# EAGLE schematic ATmega328 (EAGLE 6.6.0)
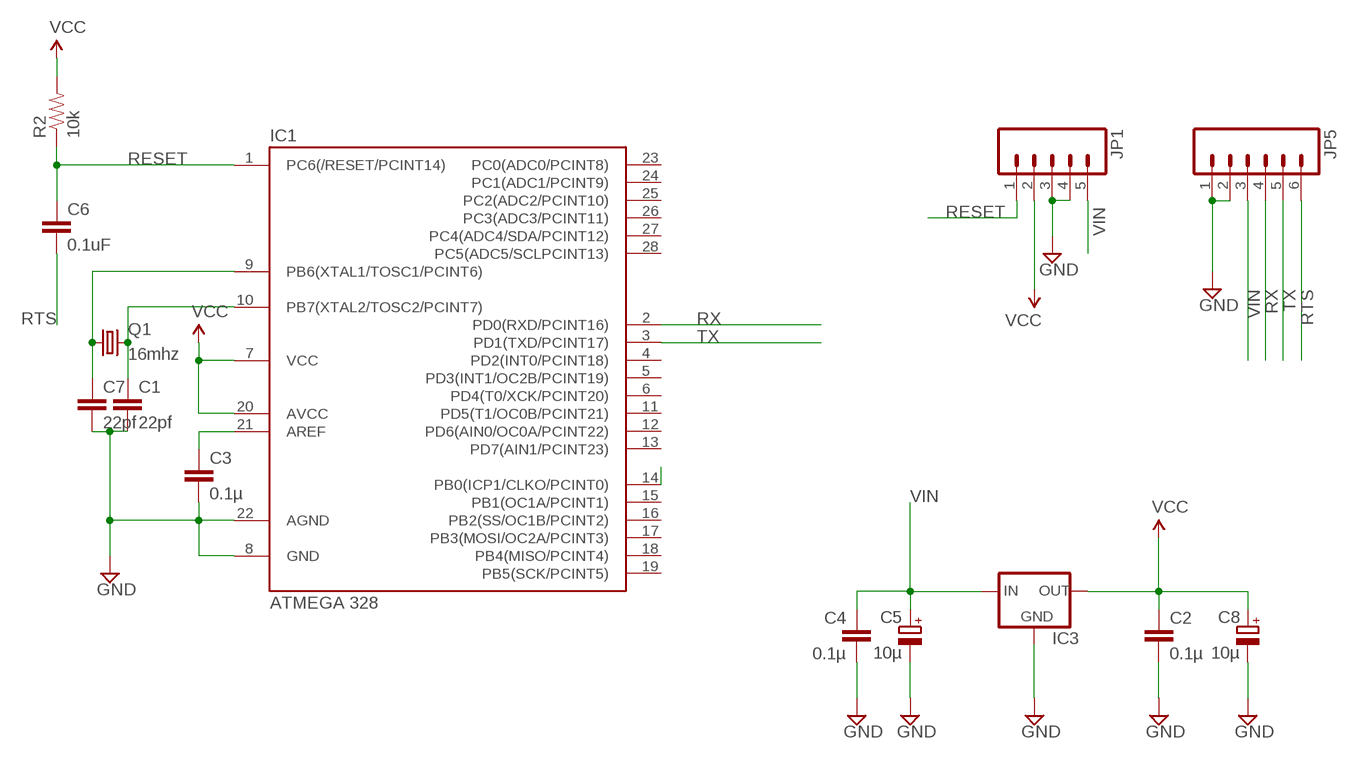
[diagram p0: schematic, sheet 1]

## Parts
C1  22pf  C-EU025-024X044  [C025-024X044]
C2  0.1µ  C-EU025-024X044  [C025-024X044]
C3  0.1µ  C-EU025-024X044  [C025-024X044]
C4  0.1µ  C-EU025-024X044  [C025-024X044]
C5  10µ  CPOL-EUE1.8-4  [E1,8-4]
C6  0.1uF  CAPPTH1  [CAP-PTH-5MM]
C7  22pf  C-EU025-024X044  [C025-024X044]
C8  10µ  CPOL-EUE1.8-4  [E1,8-4]
IC1  ATMEGA 328  ATMEGA48/88/168-PU  [DIL28-3]
IC3  V_REG_78XXSIDE  [78XXL]
JP1  M05PTH_LONGPADS  [1X05_LONGPADS]
JP5  M06NO_SILK  [1X06_NO_SILK]
Q1  16mhz  CRYSTALHC49S  [HC49/S]
R2  10k  RESISTORPTH-1/6W  [1/6W-RES]

## Nets
GND [power]: C1.2 C2.2 C3.2 C4.2 C5.- C7.2 C8.- IC1.8(GND) IC1.22(AGND) IC3.GND JP1.3 JP1.4 JP5.1 JP5.2
N$1: C7.1 IC1.9(PB6(XTAL1/TOSC1/PCINT6)) Q1.1
N$14: IC1.14(PB0(ICP1/CLKO/PCINT0))
N$19: C3.1 IC1.21(AREF)
N$21: C1.1 IC1.10(PB7(XTAL2/TOSC2/PCINT7)) Q1.2
RESET: C6.1 IC1.1(PC6(/RESET/PCINT14)) JP1.1 R2.1
RTS: C6.2 JP5.6
RX: IC1.2(PD0(RXD/PCINT16)) JP5.4
TX: IC1.3(PD1(TXD/PCINT17)) JP5.5
VCC [power]: C2.1 C8.+ IC1.7(VCC) IC1.20(AVCC) IC3.OUT JP1.2 R2.2
VIN [power]: C4.1 C5.+ IC3.IN JP1.5 JP5.3
Unconnected: IC1.4(PD2(INT0/PCINT18)) IC1.5(PD3(INT1/OC2B/PCINT19)) IC1.6(PD4(T0/XCK/PCINT20)) IC1.11(PD5(T1/OC0B/PCINT21)) IC1.12(PD6(AIN0/OC0A/PCINT22)) IC1.13(PD7(AIN1/PCINT23)) IC1.15(PB1(OC1A/PCINT1)) IC1.16(PB2(SS/OC1B/PCINT2)) IC1.17(PB3(MOSI/OC2A/PCINT3)) IC1.18(PB4(MISO/PCINT4)) IC1.19(PB5(SCK/PCINT5)) IC1.23(PC0(ADC0/PCINT8)) IC1.24(PC1(ADC1/PCINT9)) IC1.25(PC2(ADC2/PCINT10)) IC1.26(PC3(ADC3/PCINT11)) IC1.27(PC4(ADC4/SDA/PCINT12)) IC1.28(PC5(ADC5/SCLPCINT13))

## Library data of the parts
C1-C4 C7 = resistor:C-EU: CAPACITOR, European symbol
C5 C8 = resistor:CPOL-EU: POLARIZED CAPACITOR, European symbol
C6 = SparkFun-Capacitors:CAP: Capacitor Standard 0603 ceramic capacitor, and 0.1" leaded capacitor.
IC1 = atmega8:ATMEGA48/88/168-PU
IC3 = SparkFun-PowerIC:V_REG_78XX: Voltage Regulator Standard 7805 5V regulator. IGO (Input Ground Output). Spark Fun Electronics SKU : COM-00107
JP1 = SparkFun-Connectors:M05: Header 5 Standard 5-pin 0.1" header. Use with straight break away headers (SKU : PRT-00116), right angle break away headers (PRT-00553), swiss pins (PRT-00743), machine pins (PRT-00117), and female headers (PRT-00115). Molex polarized connector foot print use with SKU : PRT-08230 with associated crimp pins and housings.
JP5 = SparkFun-Connectors:M06: Header 6 Standard 6-pin 0.1" header. Use with straight break away headers (SKU : PRT-00116), right angle break away headers (PRT-00553), swiss pins (PRT-00743), machine pins (PRT-00117), and female headers (PRT-00115). Molex polarized connector foot print use with SKU : PRT-08094 with associated crimp pins and housings. NOTES ON THE VARIANTS LOCK and LOCK_LONGPADS... This footprint was designed to help hold the alignment of a through-hole component (i.e. 6-pin header) while soldering it into place. You may notice that each hole has been shifted either up or down by 0.005 of an inch from it's more standard position (which is a perfectly straight line). This slight alteration caused the pins (the squares in the middle) to touch the edges of the holes. Because they are alternating, it causes a "brace" to hold the component in place. 0.005 has proven to be the perfect amount of "off-center" position when using our standard breakaway headers. Although looks a little odd when you look at the bare footprint, once you have a header in there, the alteration is very hard to notice. Also,if you push a header all the way into place, it is covered up entirely on the bottom side. This idea of altering the position of holes to aid alignment will be further integrated into the Sparkfun Library for other footprints. It can help hold any component with 3 or more connection pins.
Q1 = adafruit:CRYSTAL: CRYSTAL; OC_FARNELL: 1667008; OC_NEWARK: unknown
R2 = SparkFun-Passives:RESISTOR: Resistor Basic schematic elements and footprints for 0603, 1206, and PTH resistors.

## Net classes
1 power: width 0.406 mm